# EAGLE schematic 辉光钟V2 (EAGLE 9.3.1)
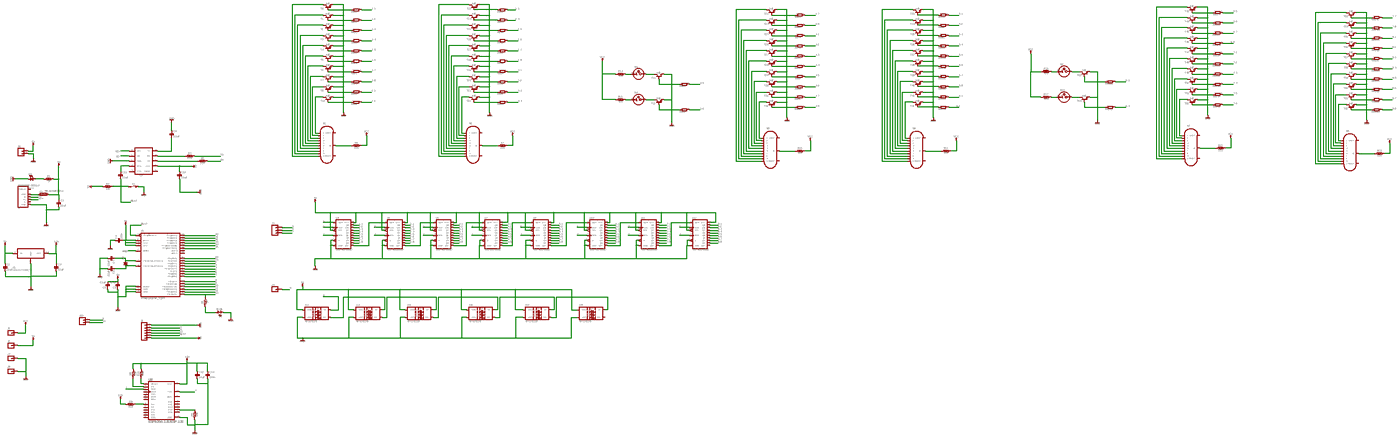
[diagram p0: schematic, sheet 1, overview]
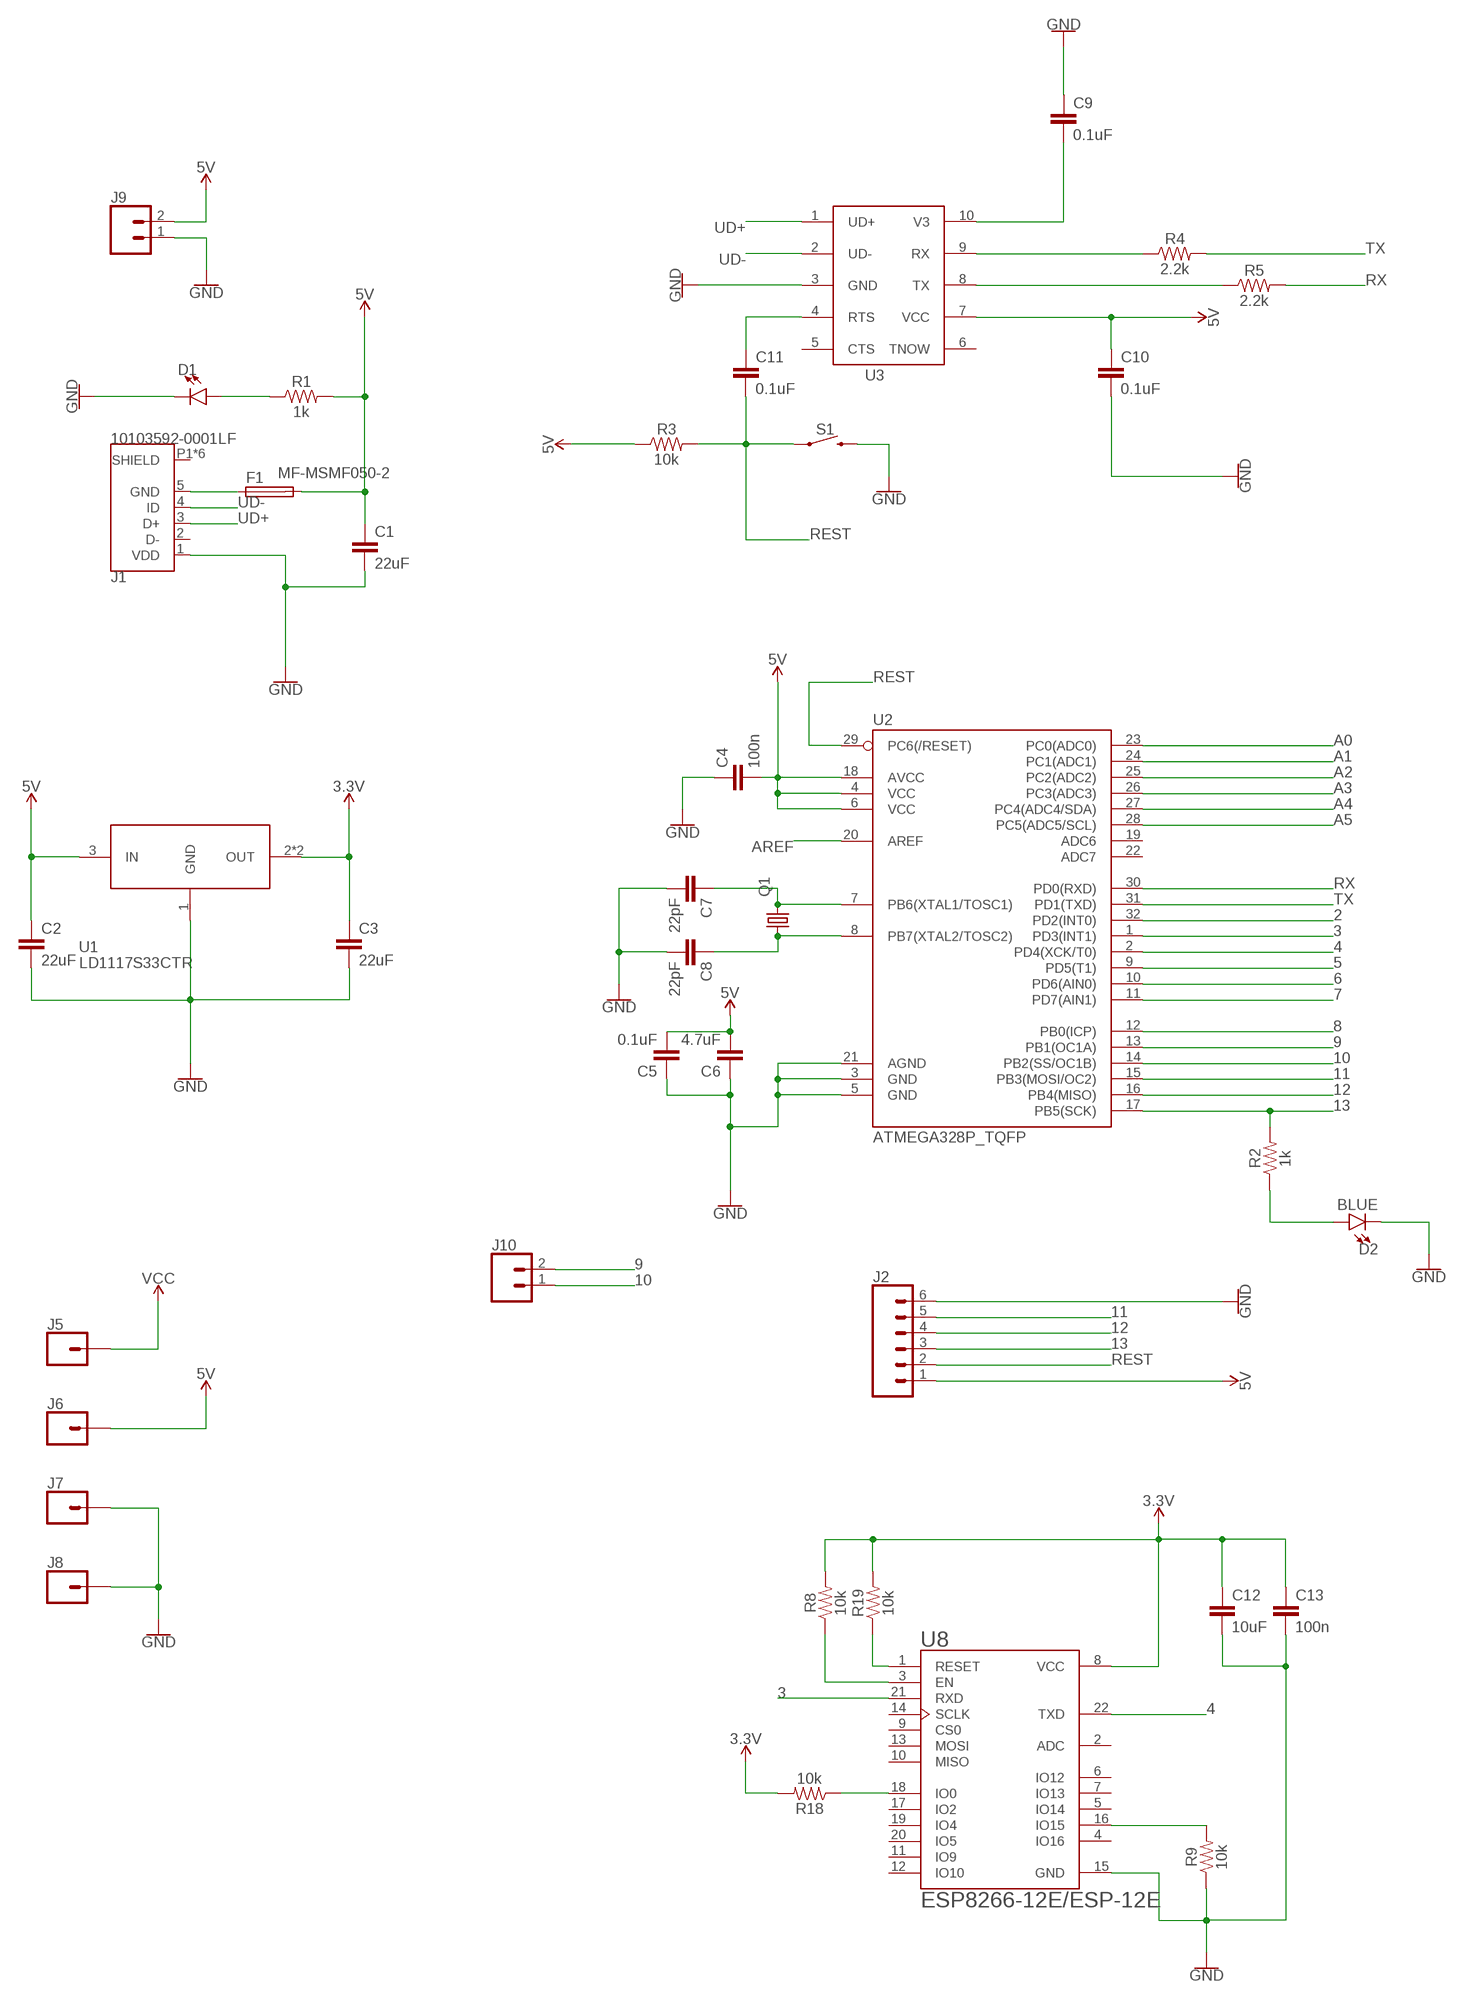
[diagram p1: schematic, sheet 1, part 1 of 4]
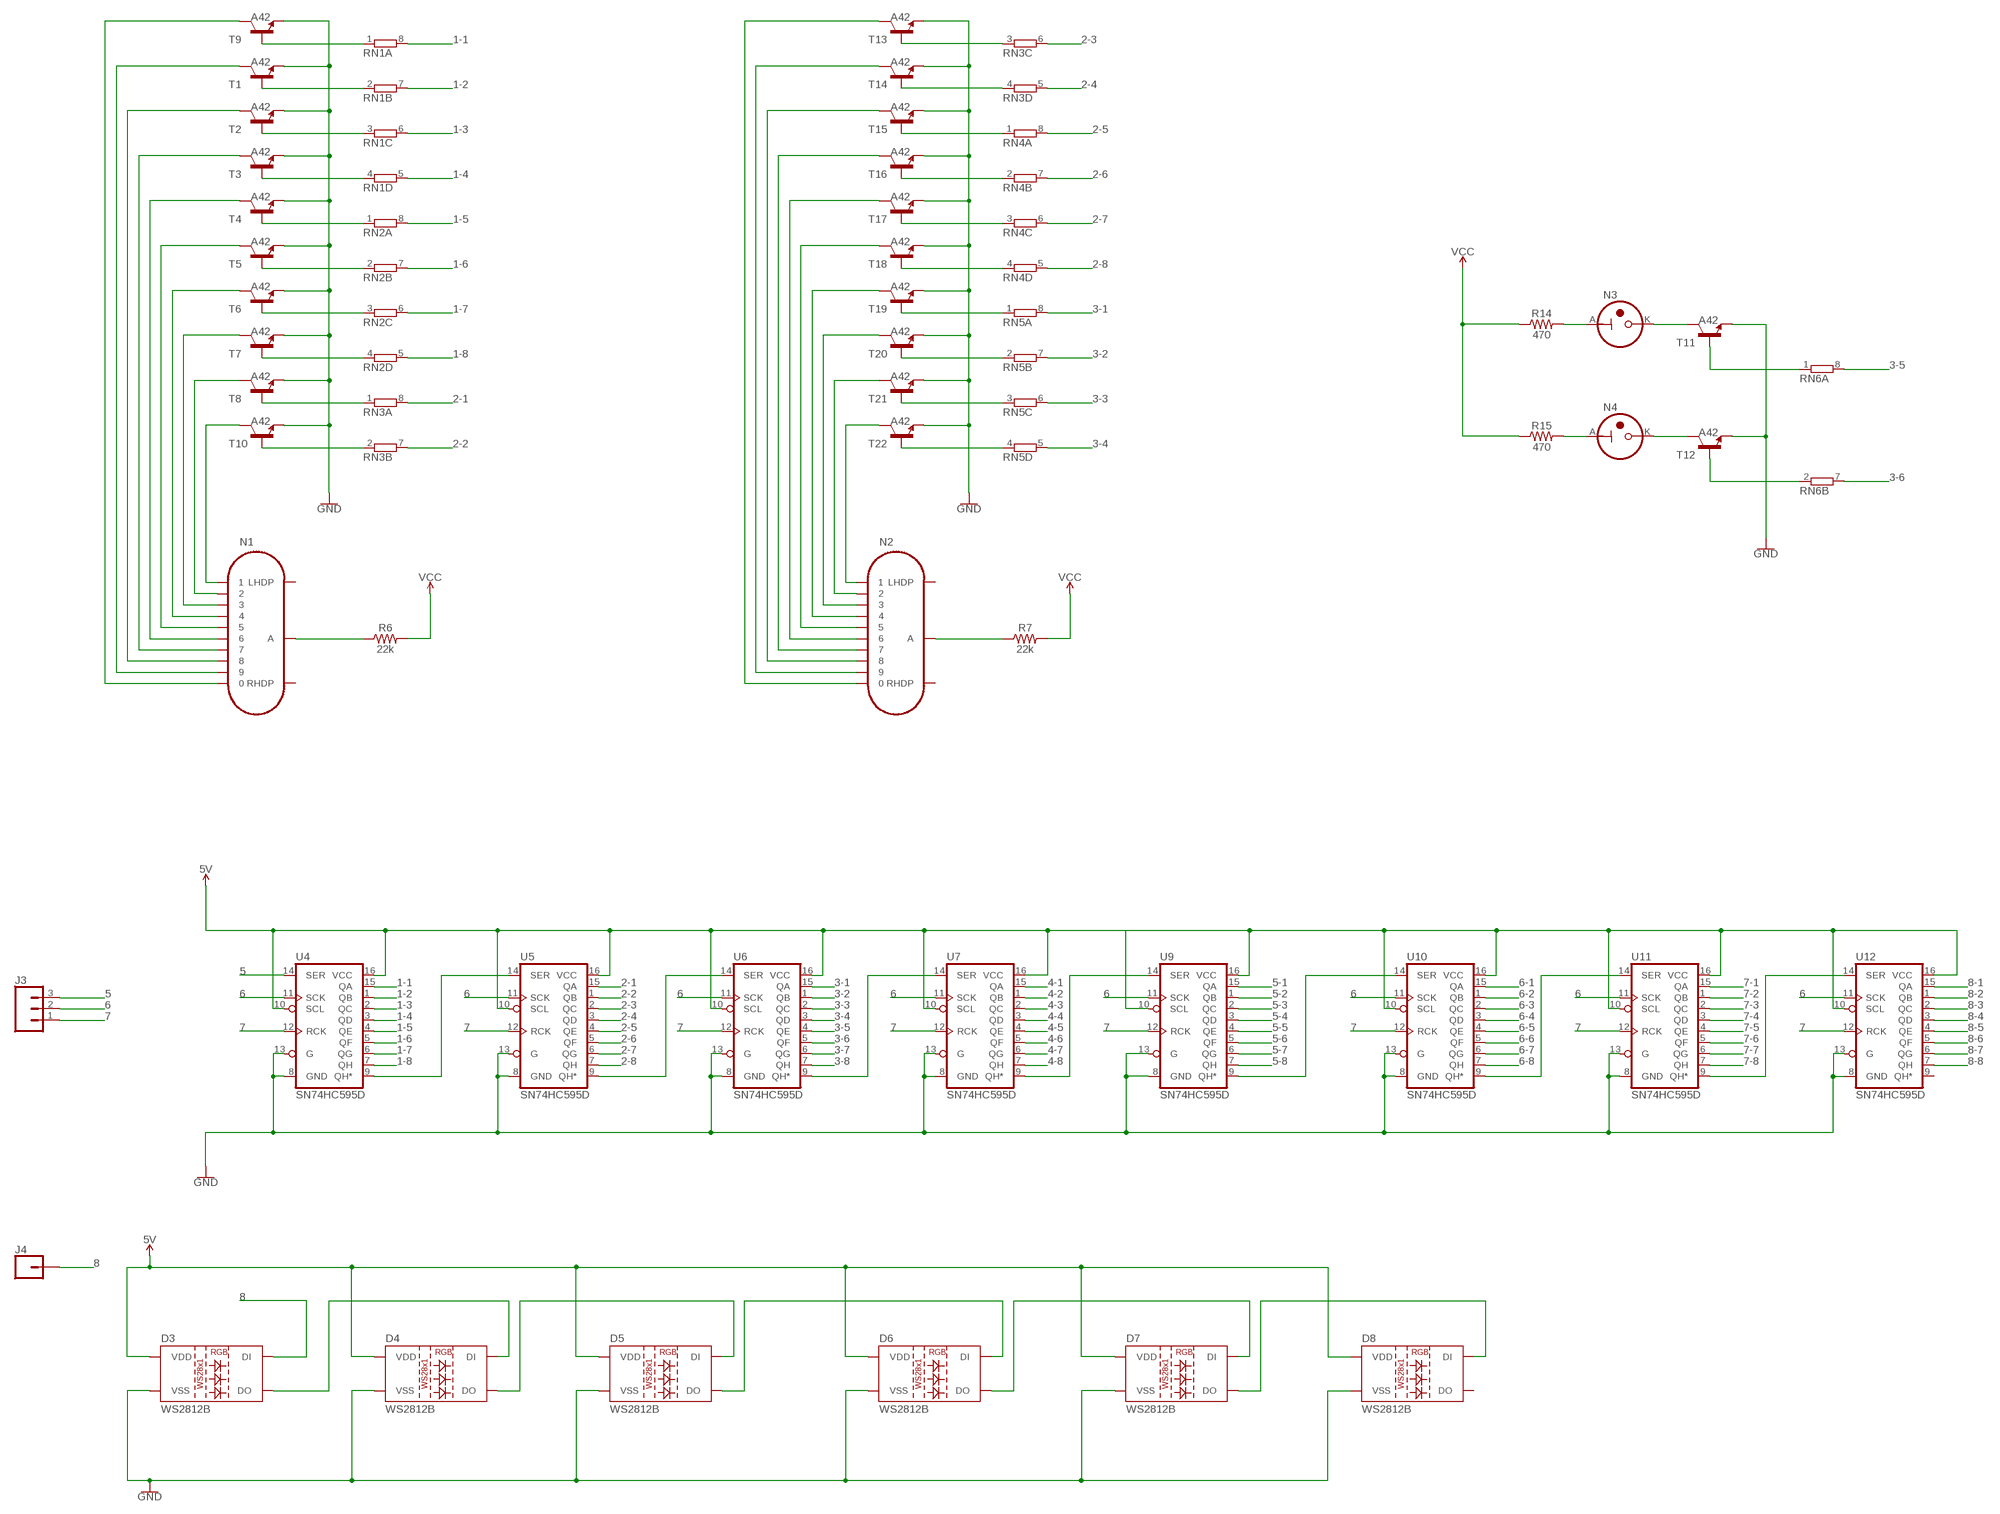
[diagram p2: schematic, sheet 1, part 2 of 4]
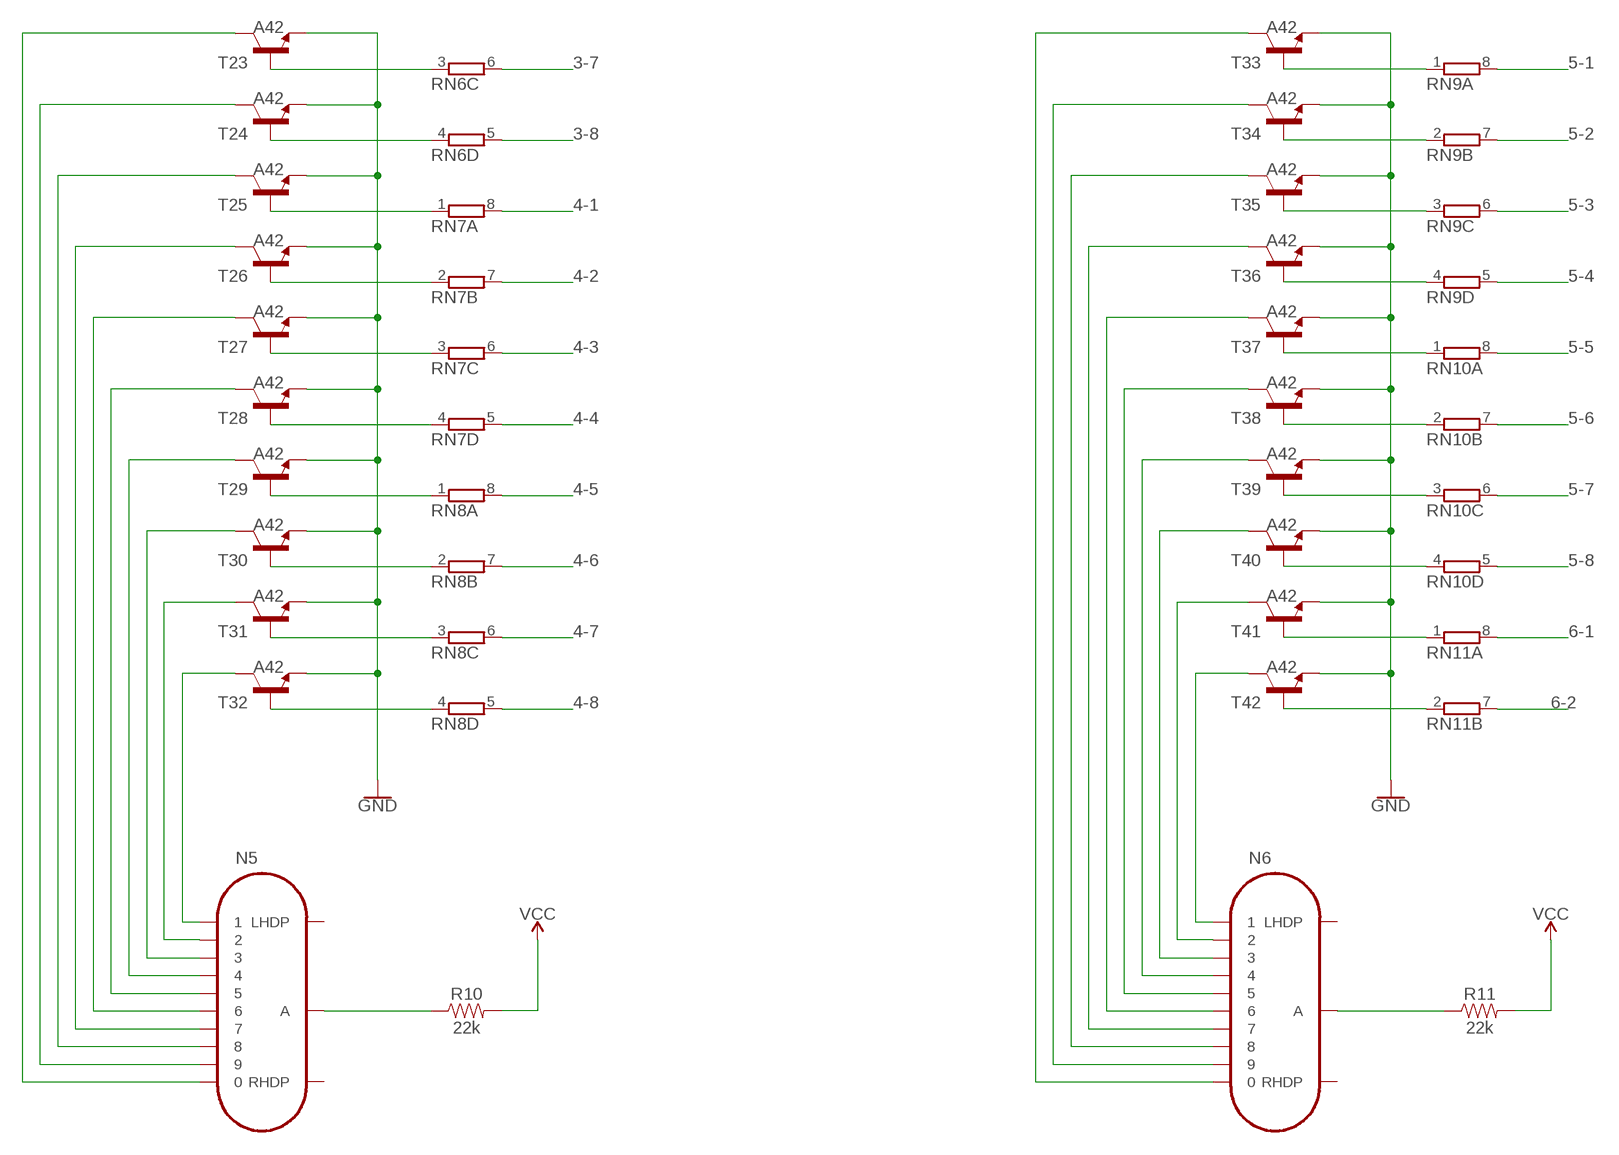
[diagram p3: schematic, sheet 1, part 3 of 4]
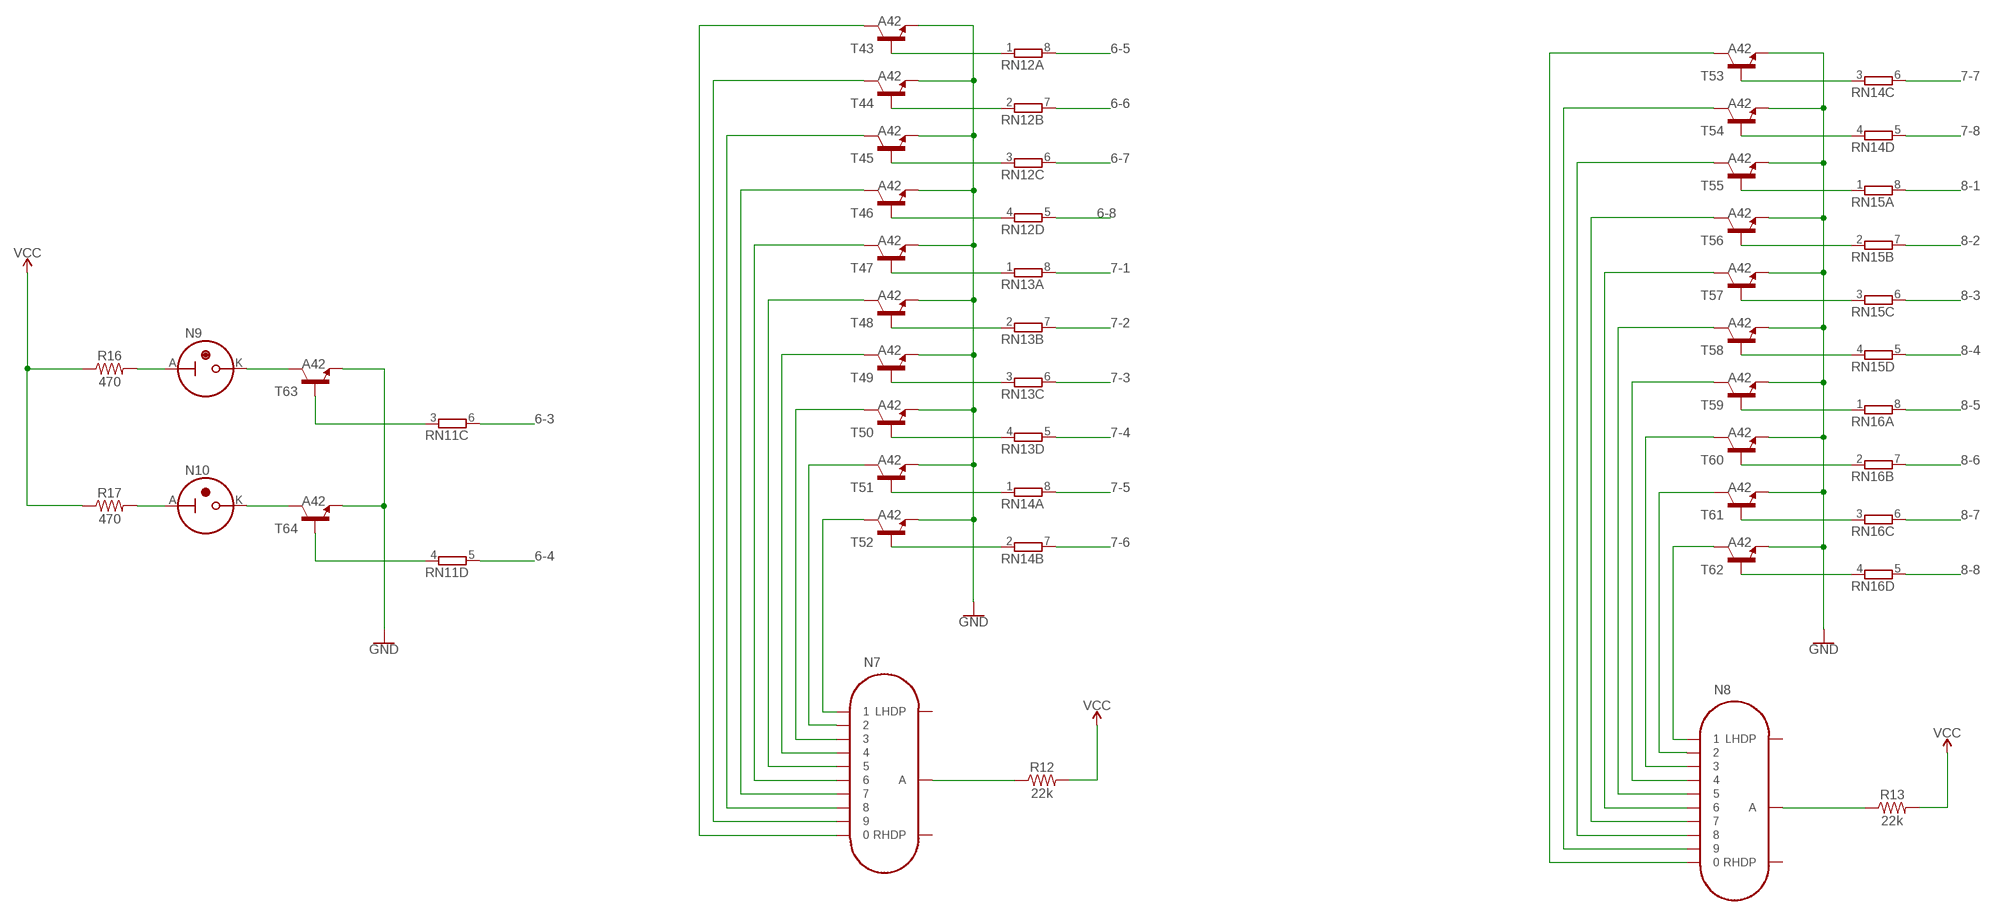
[diagram p4: schematic, sheet 1, part 4 of 4]

## Parts
C1  22uF  22UF-0805-6.3V-20%  [0805]
C2  22uF  22UF-0805-6.3V-20%  [0805]
C3  22uF  22UF-0805-6.3V-20%  [0805]
C4  100n  47NF-0603-25V-5%  [0603]
C5  0.1uF  0.1UF-0603-25V-(+80/-20%)  [0603]
C6  4.7uF  4.7UF0603  [0603]
C7  22pF  22PF-0603-50V-5%  [0603]
C8  22pF  22PF-0603-50V-5%  [0603]
C9  0.1uF  0.1UF-0603-25V-(+80/-20%)  [0603]
C10  0.1uF  0.1UF-0603-25V-(+80/-20%)  [0603]
C11  0.1uF  0.1UF-0603-25V-(+80/-20%)  [0603]
C12  10uF  10UF-0603-6.3V-20%  [0603]
C13  100n  10UF-0603-6.3V-20%  [0603]
D1  LED0603  [LED-0603]
D2  BLUE  LED-BLUE0603  [LED-0603]
D3  WS2812B  [WS2812B]
D4  WS2812B  [WS2812B]
D5  WS2812B  [WS2812B]
D6  WS2812B  [WS2812B]
D7  WS2812B  [WS2812B]
D8  WS2812B  [WS2812B]
F1  MF-MSMF050-2  [FUSM1812X02]
J1  10103592-0001LF  [AMPHENOL_10103592-0001LF]
J2  CONN_06NO_SILK_FEMALE_PTH  [1X06_NO_SILK]
J3  CONN_03  [1X03]
J4  CONN_01  [1X01]
J5  CONN_01  [1X01]
J6  CONN_01  [1X01]
J7  CONN_01  [1X01]
J8  CONN_01  [1X01]
J9  CONN_02  [1X02]
J10  CONN_02  [1X02]
N1  IN-14  [IN-14]
N2  IN-14  [IN-14]
N3  IN-3  [IN-3]
N4  IN-3  [IN-3]
N5  IN-14  [IN-14]
N6  IN-14  [IN-14]
N7  IN-14  [IN-14]
N8  IN-14  [IN-14]
N9  IN-3  [IN-3]
N10  IN-3  [IN-3]
Q1  KX-7  [3.2X2.5_KX-7]
R1  1k  1KOHM-0603-1/10W-1%  [0603]
R2  1k  1KOHM-0603-1/10W-1%  [0603]
R3  10k  10KOHM-0603-1/10W-1%  [0603]
R4  2.2k  2.2KOHM-0603-1/10W-1%  [0603]
R5  2.2k  2.2KOHM-0603-1/10W-1%  [0603]
R6  22k  22KOHM-0603-1/10W-1%  [0603]
R7  22k  22KOHM-0603-1/10W-1%  [0603]
R8  10k  1KOHM-0603-1/10W-1%  [0603]
R9  10k  1KOHM-0603-1/10W-1%  [0603]
R10  22k  22KOHM-0603-1/10W-1%  [0603]
R11  22k  22KOHM-0603-1/10W-1%  [0603]
R12  22k  22KOHM-0603-1/10W-1%  [0603]
R13  22k  22KOHM-0603-1/10W-1%  [0603]
R14  470  470OHM-0603-1/10W-1%  [0603]
R15  470  470OHM-0603-1/10W-1%  [0603]
R16  470  470OHM-0603-1/10W-1%  [0603]
R17  470  470OHM-0603-1/10W-1%  [0603]
R18  10k  1KOHM-0603-1/10W-1%  [0603]
R19  10k  1KOHM-0603-1/10W-1%  [0603]
RN1  4R-N0603-ARC  [0603-ARC]
RN2  4R-N0603-ARC  [0603-ARC]
RN3  4R-N0603-ARC  [0603-ARC]
RN4  4R-N0603-ARC  [0603-ARC]
RN5  4R-N0603-ARC  [0603-ARC]
RN6  4R-N0603-ARC  [0603-ARC]
RN7  4R-N0603-ARC  [0603-ARC]
RN8  4R-N0603-ARC  [0603-ARC]
RN9  4R-N0603-ARC  [0603-ARC]
RN10  4R-N0603-ARC  [0603-ARC]
RN11  4R-N0603-ARC  [0603-ARC]
RN12  4R-N0603-ARC  [0603-ARC]
RN13  4R-N0603-ARC  [0603-ARC]
RN14  4R-N0603-ARC  [0603-ARC]
RN15  4R-N0603-ARC  [0603-ARC]
RN16  4R-N0603-ARC  [0603-ARC]
S1  MOMENTARY-SWITCH-SPST-SMD-6.0X3.5MM  [TACTILE_SWITCH_SMD_6.0X3.5MM]
T1  A42  BC850  [SOT23]
T2  A42  BC850  [SOT23]
T3  A42  BC850  [SOT23]
T4  A42  BC850  [SOT23]
T5  A42  BC850  [SOT23]
T6  A42  BC850  [SOT23]
T7  A42  BC850  [SOT23]
T8  A42  BC850  [SOT23]
T9  A42  BC850  [SOT23]
T10  A42  BC850  [SOT23]
T11  A42  BC850  [SOT23]
T12  A42  BC850  [SOT23]
T13  A42  BC850  [SOT23]
T14  A42  BC850  [SOT23]
T15  A42  BC850  [SOT23]
T16  A42  BC850  [SOT23]
T17  A42  BC850  [SOT23]
T18  A42  BC850  [SOT23]
T19  A42  BC850  [SOT23]
T20  A42  BC850  [SOT23]
T21  A42  BC850  [SOT23]
T22  A42  BC850  [SOT23]
T23  A42  BC850  [SOT23]
T24  A42  BC850  [SOT23]
T25  A42  BC850  [SOT23]
T26  A42  BC850  [SOT23]
T27  A42  BC850  [SOT23]
T28  A42  BC850  [SOT23]
T29  A42  BC850  [SOT23]
T30  A42  BC850  [SOT23]
T31  A42  BC850  [SOT23]
T32  A42  BC850  [SOT23]
T33  A42  BC850  [SOT23]
T34  A42  BC850  [SOT23]
T35  A42  BC850  [SOT23]
T36  A42  BC850  [SOT23]
T37  A42  BC850  [SOT23]
T38  A42  BC850  [SOT23]
T39  A42  BC850  [SOT23]
T40  A42  BC850  [SOT23]
T41  A42  BC850  [SOT23]
T42  A42  BC850  [SOT23]
T43  A42  BC850  [SOT23]
T44  A42  BC850  [SOT23]
T45  A42  BC850  [SOT23]
T46  A42  BC850  [SOT23]
T47  A42  BC850  [SOT23]
T48  A42  BC850  [SOT23]
T49  A42  BC850  [SOT23]
T50  A42  BC850  [SOT23]
T51  A42  BC850  [SOT23]
T52  A42  BC850  [SOT23]
T53  A42  BC850  [SOT23]
T54  A42  BC850  [SOT23]
T55  A42  BC850  [SOT23]
T56  A42  BC850  [SOT23]
T57  A42  BC850  [SOT23]
T58  A42  BC850  [SOT23]
T59  A42  BC850  [SOT23]
T60  A42  BC850  [SOT23]
T61  A42  BC850  [SOT23]
T62  A42  BC850  [SOT23]
T63  A42  BC850  [SOT23]
T64  A42  BC850  [SOT23]
U1  LD1117S33CTR  [SOT223]
U2  ATMEGA328P_TQFP  [TQFP32-08]
U3  CH340ESMD  [MSOP10]
U4  SN74HC595D  74HC595D  [SO16]
U5  SN74HC595D  74HC595D  [SO16]
U6  SN74HC595D  74HC595D  [SO16]
U7  SN74HC595D  74HC595D  [SO16]
U8  ESP8266-12E/ESP-12E  [XCVR_ESP8266-12E/ESP-12E]
U9  SN74HC595D  74HC595D  [SO16]
U10  SN74HC595D  74HC595D  [SO16]
U11  SN74HC595D  74HC595D  [SO16]
U12  SN74HC595D  74HC595D  [SO16]

## Nets
1-1: RN1.8 U4.15(QA)
1-2: RN1.7 U4.1(QB)
1-3: RN1.6 U4.2(QC)
1-4: RN1.5 U4.3(QD)
1-5: RN2.8 U4.4(QE)
1-6: RN2.7 U4.5(QF)
1-7: RN2.6 U4.6(QG)
1-8: RN2.5 U4.7(QH)
2: U2.32(PD2(INT0))
2-1: RN3.8 U5.15(QA)
2-2: RN3.7 U5.1(QB)
2-3: RN3.6 U5.2(QC)
2-4: RN3.5 U5.3(QD)
2-5: RN4.8 U5.4(QE)
2-6: RN4.7 U5.5(QF)
2-7: RN4.6 U5.6(QG)
2-8: RN4.5 U5.7(QH)
3: U2.1(PD3(INT1)) U8.21(RXD)
3-1: RN5.8 U6.15(QA)
3-2: RN5.7 U6.1(QB)
3-3: RN5.6 U6.2(QC)
3-4: RN5.5 U6.3(QD)
3-5: RN6.8 U6.4(QE)
3-6: RN6.7 U6.5(QF)
3-7: RN6.6 U6.6(QG)
3-8: RN6.5 U6.7(QH)
3.3V: C3.1 C12.1 C13.1 R8.2 R18.2 R19.2 U1.2(OUT) U1.4(OUT) U8.8(VCC)
4: U2.2(PD4(XCK/T0)) U8.22(TXD)
4-1: RN7.8 U7.15(QA)
4-2: RN7.7 U7.1(QB)
4-3: RN7.6 U7.2(QC)
4-4: RN7.5 U7.3(QD)
4-5: RN8.8 U7.4(QE)
4-6: RN8.7 U7.5(QF)
4-7: RN8.6 U7.6(QG)
4-8: RN8.5 U7.7(QH)
5: J3.3 U2.9(PD5(T1)) U4.14(SER)
5-1: RN9.8 U9.15(QA)
5-2: RN9.7 U9.1(QB)
5-3: RN9.6 U9.2(QC)
5-4: RN9.5 U9.3(QD)
5-5: RN10.8 U9.4(QE)
5-6: RN10.7 U9.5(QF)
5-7: RN10.6 U9.6(QG)
5-8: RN10.5 U9.7(QH)
5V: C1.1 C2.1 C4.2 C5.2 C6.2 C10.1 D3.1(VDD) D4.1(VDD) D5.1(VDD) D6.1(VDD) D7.1(VDD) D8.1(VDD) F1.2 J2.1 J6.1 J9.2 R1.2 R3.1 U1.3(IN) U2.4(VCC) U2.6(VCC) U2.18(AVCC) U3.7(VCC) U4.10(SCL) U4.16(VCC) U5.10(SCL) U5.16(VCC) U6.10(SCL) U6.16(VCC) U7.10(SCL) U7.16(VCC) U9.10(SCL) U9.16(VCC) U10.10(SCL) U10.16(VCC) U11.10(SCL) U11.16(VCC) U12.10(SCL) U12.16(VCC)
6: J3.2 U2.10(PD6(AIN0)) U4.11(SCK) U5.11(SCK) U6.11(SCK) U7.11(SCK) U9.11(SCK) U10.11(SCK) U11.11(SCK) U12.11(SCK)
6-1: RN11.8 U10.15(QA)
6-2: RN11.7 U10.1(QB)
6-3: RN11.6 U10.2(QC)
6-4: RN11.5 U10.3(QD)
6-5: RN12.8 U10.4(QE)
6-6: RN12.7 U10.5(QF)
6-7: RN12.6 U10.6(QG)
6-8: RN12.5 U10.7(QH)
7: J3.1 U2.11(PD7(AIN1)) U4.12(RCK) U5.12(RCK) U6.12(RCK) U7.12(RCK) U9.12(RCK) U10.12(RCK) U11.12(RCK) U12.12(RCK)
7-1: RN13.8 U11.15(QA)
7-2: RN13.7 U11.1(QB)
7-3: RN13.6 U11.2(QC)
7-4: RN13.5 U11.3(QD)
7-5: RN14.8 U11.4(QE)
7-6: RN14.7 U11.5(QF)
7-7: RN14.6 U11.6(QG)
7-8: RN14.5 U11.7(QH)
8: D3.4(DI) J4.1 U2.12(PB0(ICP))
8-1: RN15.8 U12.15(QA)
8-2: RN15.7 U12.1(QB)
8-3: RN15.6 U12.2(QC)
8-4: RN15.5 U12.3(QD)
8-5: RN16.8 U12.4(QE)
8-6: RN16.7 U12.5(QF)
8-7: RN16.6 U12.6(QG)
8-8: RN16.5 U12.7(QH)
9: J10.2 U2.13(PB1(OC1A))
10: J10.1 U2.14(PB2(SS/OC1B))
11: J2.5 U2.15(PB3(MOSI/OC2))
12: J2.4 U2.16(PB4(MISO))
13: J2.3 R2.2 U2.17(PB5(SCK))
A0: U2.23(PC0(ADC0))
A1: U2.24(PC1(ADC1))
A2: U2.25(PC2(ADC2))
A3: U2.26(PC3(ADC3))
A4: U2.27(PC4(ADC4/SDA))
A5: U2.28(PC5(ADC5/SCL))
AREF: U2.20(AREF)
GND: C1.2 C2.2 C3.2 C4.1 C5.1 C6.1 C7.2 C8.2 C9.1 C10.2 C12.2 C13.2 D1.C D2.C D3.3(VSS) D4.3(VSS) D5.3(VSS) D6.3(VSS) D7.3(VSS) D8.3(VSS) J1.1(VDD) J2.6 J7.1 J8.1 J9.1 R9.1 S1.2 T1.2(E) T2.2(E) T3.2(E) T4.2(E) T5.2(E) T6.2(E) T7.2(E) T8.2(E) T9.2(E) T10.2(E) T11.2(E) T12.2(E) T13.2(E) T14.2(E) T15.2(E) T16.2(E) T17.2(E) T18.2(E) T19.2(E) T20.2(E) T21.2(E) T22.2(E) T23.2(E) T24.2(E) T25.2(E) T26.2(E) T27.2(E) T28.2(E) T29.2(E) T30.2(E) T31.2(E) T32.2(E) T33.2(E) T34.2(E) T35.2(E) T36.2(E) T37.2(E) T38.2(E) T39.2(E) T40.2(E) T41.2(E) T42.2(E) T43.2(E) T44.2(E) T45.2(E) T46.2(E) T47.2(E) T48.2(E) T49.2(E) T50.2(E) T51.2(E) T52.2(E) T53.2(E) T54.2(E) T55.2(E) T56.2(E) T57.2(E) T58.2(E) T59.2(E) T60.2(E) T61.2(E) T62.2(E) T63.2(E) T64.2(E) U1.1(GND) U2.3(GND) U2.5(GND) U2.21(AGND) U3.3(GND) U4.8(GND) U4.13(G) U5.8(GND) U5.13(G) U6.8(GND) U6.13(G) U7.8(GND) U7.13(G) U8.15(GND) U9.8(GND) U9.13(G) U10.8(GND) U10.13(G) U11.8(GND) U11.13(G) U12.8(GND) U12.13(G)
N$1: F1.1 J1.5(GND)
N$2: U4.9(QH*) U5.14(SER)
N$3: U5.9(QH*) U6.14(SER)
N$4: C7.1 Q1.3 U2.7(PB6(XTAL1/TOSC1))
N$5: D1.A R1.1
N$6: C8.1 Q1.1 U2.8(PB7(XTAL2/TOSC2))
N$7: U6.9(QH*) U7.14(SER)
N$8: D2.A R2.1
N$9: C11.1 U3.4(RTS)
N$20: N1.1 T10.3(C)
N$21: N1.2 T8.3(C)
N$22: N1.3 T7.3(C)
N$23: N1.4 T6.3(C)
N$24: N1.5 T5.3(C)
N$25: N1.6 T4.3(C)
N$26: N1.7 T3.3(C)
N$27: N1.8 T2.3(C)
N$28: N1.9 T1.3(C)
N$29: N1.0 T9.3(C)
N$30: RN1.1 T9.1(B)
N$31: RN1.2 T1.1(B)
N$32: RN1.3 T2.1(B)
N$33: RN1.4 T3.1(B)
N$34: R4.1 U3.9(RX)
N$35: R5.1 U3.8(TX)
N$36: RN2.1 T4.1(B)
N$37: RN2.2 T5.1(B)
N$38: C9.2 U3.10(V3)
N$39: RN2.3 T6.1(B)
N$40: RN2.4 T7.1(B)
N$43: N1.A R6.1
N$44: RN3.1 T8.1(B)
N$45: RN3.2 T10.1(B)
N$46: N2.1 T22.3(C)
N$47: N2.2 T21.3(C)
N$48: N2.3 T20.3(C)
N$49: N2.4 T19.3(C)
N$50: N2.5 T18.3(C)
N$51: N2.6 T17.3(C)
N$52: N2.7 T16.3(C)
N$53: N2.8 T15.3(C)
N$54: N2.9 T14.3(C)
N$55: N2.0 T13.3(C)
N$56: N2.A R7.1
N$59: RN3.3 T13.1(B)
N$60: RN3.4 T14.1(B)
N$61: RN4.1 T15.1(B)
N$62: RN4.2 T16.1(B)
N$63: RN4.3 T17.1(B)
N$64: RN4.4 T18.1(B)
N$65: RN5.1 T19.1(B)
N$66: RN5.2 T20.1(B)
N$67: RN5.3 T21.1(B)
N$68: RN5.4 T22.1(B)
N$76: R8.1 U8.3(EN)
N$77: R9.2 U8.16(IO15)
N$82: U7.9(QH*) U9.14(SER)
N$84: N5.1 T32.3(C)
N$85: N5.2 T31.3(C)
N$86: N5.3 T30.3(C)
N$87: N5.4 T29.3(C)
N$88: N5.5 T28.3(C)
N$89: N5.6 T27.3(C)
N$90: N5.7 T26.3(C)
N$91: N5.8 T25.3(C)
N$92: N5.9 T24.3(C)
N$93: N5.0 T23.3(C)
N$94: N5.A R10.1
N$97: RN6.3 T23.1(B)
N$98: RN6.4 T24.1(B)
N$99: RN7.1 T25.1(B)
N$100: RN7.2 T26.1(B)
N$101: RN7.3 T27.1(B)
N$102: RN7.4 T28.1(B)
N$103: RN8.1 T29.1(B)
N$104: RN8.2 T30.1(B)
N$105: RN8.3 T31.1(B)
N$106: RN8.4 T32.1(B)
N$117: N6.1 T42.3(C)
N$118: N6.2 T41.3(C)
N$119: N6.3 T40.3(C)
N$120: N6.4 T39.3(C)
N$121: N6.5 T38.3(C)
N$122: N6.6 T37.3(C)
N$123: N6.7 T36.3(C)
N$124: N6.8 T35.3(C)
N$125: N6.9 T34.3(C)
N$126: N6.0 T33.3(C)
N$127: N6.A R11.1
N$130: RN9.1 T33.1(B)
N$131: RN9.2 T34.1(B)
N$132: RN9.3 T35.1(B)
N$133: RN9.4 T36.1(B)
N$134: RN10.1 T37.1(B)
N$135: RN10.2 T38.1(B)
N$136: RN10.3 T39.1(B)
N$137: RN10.4 T40.1(B)
N$138: RN11.1 T41.1(B)
N$139: RN11.2 T42.1(B)
N$150: N7.1 T52.3(C)
N$151: N7.2 T51.3(C)
N$152: N7.3 T50.3(C)
N$153: N7.4 T49.3(C)
N$154: N7.5 T48.3(C)
N$155: N7.6 T47.3(C)
N$156: N7.7 T46.3(C)
N$157: N7.8 T45.3(C)
N$158: N7.9 T44.3(C)
N$159: N7.0 T43.3(C)
N$160: N7.A R12.1
N$163: RN12.1 T43.1(B)
N$164: RN12.2 T44.1(B)
N$165: RN12.3 T45.1(B)
N$166: RN12.4 T46.1(B)
N$167: RN13.1 T47.1(B)
N$168: RN13.2 T48.1(B)
N$169: RN13.3 T49.1(B)
N$170: RN13.4 T50.1(B)
N$171: RN14.1 T51.1(B)
N$172: RN14.2 T52.1(B)
N$183: N8.1 T62.3(C)
N$184: N8.2 T61.3(C)
N$185: N8.3 T60.3(C)
N$186: N8.4 T59.3(C)
N$187: N8.5 T58.3(C)
N$188: N8.6 T57.3(C)
N$189: N8.7 T56.3(C)
N$190: N8.8 T55.3(C)
N$191: N8.9 T54.3(C)
N$192: N8.0 T53.3(C)
N$193: N8.A R13.1
N$196: RN14.3 T53.1(B)
N$197: RN14.4 T54.1(B)
N$198: RN15.1 T55.1(B)
N$199: RN15.2 T56.1(B)
N$200: RN15.3 T57.1(B)
N$201: RN15.4 T58.1(B)
N$202: RN16.1 T59.1(B)
N$203: RN16.2 T60.1(B)
N$204: RN16.3 T61.1(B)
N$205: RN16.4 T62.1(B)
N$216: N3.A R14.2
N$217: N3.K T11.3(C)
N$218: N4.A R15.2
N$219: N4.K T12.3(C)
N$220: RN6.1 T11.1(B)
N$221: RN6.2 T12.1(B)
N$224: N9.A R16.2
N$225: N9.K T63.3(C)
N$226: N10.A R17.2
N$227: N10.K T64.3(C)
N$228: RN11.3 T63.1(B)
N$229: RN11.4 T64.1(B)
N$232: R19.1 U8.1(RESET)
N$233: D3.2(DO) D4.4(DI)
N$234: R18.1 U8.18(IO0)
N$235: D4.2(DO) D5.4(DI)
N$236: D5.2(DO) D6.4(DI)
N$237: D6.2(DO) D7.4(DI)
N$238: D7.2(DO) D8.4(DI)
N$241: U10.9(QH*) U11.14(SER)
N$248: U11.9(QH*) U12.14(SER)
N$256: U9.9(QH*) U10.14(SER)
REST: C11.2 J2.2 R3.2 S1.1 U2.29(PC6(/RESET))
RX: R5.2 U2.30(PD0(RXD))
TX: R4.2 U2.31(PD1(TXD))
UD+: J1.3(D+) U3.1(UD+)
UD-: J1.4(ID) U3.2(UD-)
VCC: J5.1 R6.2 R7.2 R10.2 R11.2 R12.2 R13.2 R14.1 R15.1 R16.1 R17.1
Unconnected: D8.2(DO) J1.2(D-) N1.LHDP N1.RHDP N2.LHDP N2.RHDP N5.LHDP N5.RHDP N6.LHDP N6.RHDP N7.LHDP N7.RHDP N8.LHDP N8.RHDP U2.19(ADC6) U2.22(ADC7) U3.5(CTS) U3.6(TNOW) U8.2(ADC) U8.4(IO16) U8.5(IO14) U8.6(IO12) U8.7(IO13) U8.9(CS0) U8.10(MISO) U8.11(IO9) U8.12(IO10) U8.13(MOSI) U8.14(SCLK) U8.17(IO2) U8.19(IO4) U8.20(IO5) U12.9(QH*)

## Power pins joined to a net without a drawn wire
SHIELD: J1.P1(SHIELD) J1.P2(SHIELD) J1.P3(SHIELD) J1.P4(SHIELD) J1.P5(SHIELD) J1.P6(SHIELD)

## Library data of the parts
C1-C3 = SparkFun-Capacitors:22UF: 22µF ceramic capacitors A capacitor is a passive two-terminal electrical component used to store electrical energy temporarily in an electric field.; PROD_ID: CAP-08402
C4 = SparkFun-Capacitors:47NF: 47nF ceramic capacitors A capacitor is a passive two-terminal electrical component used to store electrical energy temporarily in an electric field.; PROD_ID: CAP-08605; VALUE: 47nF
C5 C9-C11 = SparkFun-Capacitors:0.1UF: 0.1µF ceramic capacitors A capacitor is a passive two-terminal electrical component used to store electrical energy temporarily in an electric field.; PROD_ID: CAP-00810
C6 = SparkFun-Capacitors:4.7UF: 4.7µF ceramic capacitors A capacitor is a passive two-terminal electrical component used to store electrical energy temporarily in an electric field.; PROD_ID: CAP-08280
C7 C8 = SparkFun-Capacitors:22PF: 22pF ceramic capacitors A capacitor is a passive two-terminal electrical component used to store electrical energy temporarily in an electric field.; PROD_ID: CAP-07876
C12 = SparkFun-Capacitors:10UF: 10.0µF ceramic capacitors A capacitor is a passive two-terminal electrical component used to store electrical energy temporarily in an electric field.; PROD_ID: CAP-11015
C13 = SparkFun-Capacitors:10UF: 10.0µF ceramic capacitors A capacitor is a passive two-terminal electrical component used to store electrical energy temporarily in an electric field.; PROD_ID: CAP-11015; VALUE: 10uF
D1 = SparkFun-LED:LED: LED (Generic) Standard schematic elements and footprints for 5mm, 3mm, 1206, and 0603 sized LEDs. Generic LEDs with no color specified.
D2 = SparkFun-LED:LED-BLUE: Blue SMD LED Used in manufacturing of various products at SparkFun Packages: 0603 - SMD 0603 package [Product Link] <http://www.digikey.com/product-detail/en/SMLE12BC7TT86/511-1589-2-ND/1641808> 1206 - SMD1206 package [Product Link] <http://www.digikey.com/product-detail/en/lite-on-inc/LTST-C150TBKT/160-1643-1-ND/573584> SparkFun Products: ESP8266 Thing-Dev Board <https://www.sparkfun.com/products/13711> RedBoard <https://www.sparkfun.com/products/12757>; PROD_ID: DIO-08575
D3-D8 = SparkFun-LED:WS2812B: WS2812B SMD addressable RGB LED 5x5mm SMD LED with built-in controller IC. Color: Red/Green/Blue mC Rating: RGB: 390, 660, 180 mcd Forward Voltage: RGB: 2.0, 3.0, 3.0 V Packages:WS2812B SparkFun Products: Blynk Board - ESP8266 <https://www.sparkfun.com/products/13794>; PROD_ID: DIO-12503
F1 = MF-MSMF050-2:MF-MSMF050-2: PTC Resettable Fuse 0.5A(hold) 1A(trip) 15V 100A 0.8W 0.15s 0.15Ohm SMD Solder Pad 1812 T/R; AVAILABILITY: Unavailable; DESCRIPTION: PTC Resettable Fuse 0.5A_hold_ 1A_trip_ 15V 100A 0.8W 0.15s 0.15Ohm SMD Solder Pad 1812 T/R; MF: Bourns; MP: MF-MSMF050-2; PACKAGE: 1812 Bourns; PRICE: None
J1 = usb:10103592-0001LF: Conn Micro USB Type B RCP 5 POS 0.65mm Solder RA SMD 5 Terminal 1 Port T/R; AVAILABILITY: Unavailable; DESCRIPTION: Micro Usb, 2.0 Type b, Rcpt, Smt; MF: Amphenol ICC; MP: 10103592-0001LF; PACKAGE: None; PRICE: None
J2 = SparkFun-Connectors:CONN_06: Multi connection point. Often used as Generic Header-pin footprint for 0.1 inch spaced/style header connections On any of the 0.1 inch spaced packages, you can populate with these: Break Away Headers - Straight (PRT-00116) Break Away Male Headers - Right Angle (PRT-00553) Female Headers (PRT-00115) Break Away Headers - Machine Pin (PRT-00117) Break Away Female Headers - Swiss Machine Pin (PRT-00743) Arduino Stackable Header - 6 Pin (PRT-09280) For SCREWTERMINALS and SPRING TERMINALS visit here: Screw Terimnals on SparkFun.com (5mm/3.5mm/2.54mm spacing) This device is also useful as a general connection point to wire up your design to another part of your project. Our various solder wires solder well into these plated through hole pads. Hook-Up Wire - Assortment (Stranded, 22 AWG) (PRT-11375) Hook-Up Wire - Assortment (Solid Core, 22 AWG) (PRT-11367) View the entire wire category on our website here; PROD_ID: CONN-08437
J3 = SparkFun-Connectors:CONN_03: Multi connection point. Often used as Generic Header-pin footprint for 0.1 inch spaced/style header connections On any of the 0.1 inch spaced packages, you can populate with these: Break Away Headers - Straight (PRT-00116) Break Away Male Headers - Right Angle (PRT-00553) Female Headers (PRT-00115) Break Away Headers - Machine Pin (PRT-00117) Break Away Female Headers - Swiss Machine Pin (PRT-00743) Stackable Header - 3 Pin (Female, 0.1") (PRT-13875) For SCREWTERMINALS and SPRING TERMINALS visit here: Screw Terimnals on SparkFun.com (5mm/3.5mm/2.54mm spacing) This device is also useful as a general connection point to wire up your design to another part of your project. Our various solder wires solder well into these plated through hole pads. Hook-Up Wire - Assortment (Stranded, 22 AWG) (PRT-11375) Hook-Up Wire - Assortment (Solid Core, 22 AWG) (PRT-11367) View the entire wire category on our website here Special notes: Molex polarized connector foot print use with SKU : PRT-08232 with associated crimp pins and housings.
J4-J8 = SparkFun-Connectors:CONN_01: Single connection point. Often used as Generic Header-pin footprint for 0.1 inch spaced/style header connections On any of the 0.1 inch spaced packages, you can populate with these: Break Away Headers - Straight (PRT-00116) Break Away Male Headers - Right Angle (PRT-00553) Female Headers (PRT-00115) Break Away Headers - Machine Pin (PRT-00117) Break Away Female Headers - Swiss Machine Pin (PRT-00743) This device is also useful as a general connection point to wire up your design to another part of your project. Our various solder wires solder well into these plated through hole pads. Hook-Up Wire - Assortment (Stranded, 22 AWG) (PRT-11375) Hook-Up Wire - Assortment (Solid Core, 22 AWG) (PRT-11367) View the entire wire category on our website here Special notes: SMTSO-256-ET is a "flush mount" nut for a 4-40 screw. We mostly use this on specialty testbeds; it is a nice way to connect hardware to your PCB at an adjustable hieght. Also note, the SNAP packages are for using a snappable style connector. We sell a baggie of snaps and they are also used on two LilyPad designs: Snap Assortment - 30 pack (male and female) (DEV-11347) LilyPad Arduino SimpleSnap (DEV-10941) LilyPad SimpleSnap Protoboard (DEV-10940)
J9 J10 = SparkFun-Connectors:CONN_02: Multi connection point. Often used as Generic Header-pin footprint for 0.1 inch spaced/style header connections On any of the 0.1 inch spaced packages, you can populate with these: Break Away Headers - Straight (PRT-00116) Break Away Male Headers - Right Angle (PRT-00553) Female Headers (PRT-00115) Break Away Headers - Machine Pin (PRT-00117) Break Away Female Headers - Swiss Machine Pin (PRT-00743) For SCREWTERMINALS and SPRING TERMINALS visit here: Screw Terimnals on SparkFun.com (5mm/3.5mm/2.54mm spacing) This device is also useful as a general connection point to wire up your design to another part of your project. Our various solder wires solder well into these plated through hole pads. Hook-Up Wire - Assortment (Stranded, 22 AWG) (PRT-11375) Hook-Up Wire - Assortment (Solid Core, 22 AWG) (PRT-11367) View the entire wire category on our website here Special notes: Molex polarized connector foot print use with: PRT-08233 with associated crimp pins and housings. 2.54_SCREWTERM for use with PRT-10571. 3.5mm Screw Terminal footprints for PRT-08084 5mm Screw Terminal footprints for use with PRT-08432
N1 N2 N5-N8 = russian-nixies:IN-14: IN-14: medium numeric frontview nixie tube
N3 N4 N9 N10 = russian-nixies:IN-3: IN-3: nixie bulb
Q1 = crystal-geyer_V1_0:KX: Quartz Crystals (MHz) SMD: KX - Serie Model Size l/w/h [mm] Frequency Range Frequency Stability Temp. Range [°C] Load Capacitance AECQ 200 availabel Datasheet KX-4 KX-5 KX-6 KX-7 KX-9A KX-9B KX-12A KX-12B KX-13 KX-20 KX-K KX-KS 1.6/1.2/0.3 2.0/1.6/0.45 2.5/2.0/0.55 3.2/2.5/0.8 5.0/3.2/1.0 5.0/3.2/1.1 6.0/3.5/1.1 6.0/3.5/1.0 7.0/5.0 /1.3 11.6/5.5/1.6 12.3/4.5/4.2 12.3/4.5/3.2 24.0 ~ 80.0 MHz 16.0 ~ 80.0 MHz 12.0 ~ 80.0 MHz 8.0 ~ 60.0 MHz 7,68 ~ 300,0 MHz 8,0 ~ 50,0 MHz 8,0 ~ 150,0 MHz 8,0 ~ 50,0 MHz 6,0 ~ 160,0 MHz 3,579 ~ 25,0 MHz 3,579 ~ 70,0 MHz 3,579 ~ 70,0 MHz ±10 … ±50ppm ±10 … ±50ppm ±10 … ±50ppm ±10 … ±50ppm ±10 … ±50ppm ±10 … ±50ppm ±10 … ±50ppm ±10 … ±50ppm ±10 … ±50ppm ±50ppm ±10 … ±50ppm ±10 … ±50ppm (*) -40°C …+85°C (*) -40°C …+125°C (*) -40°C …+125°C (*) -40°C …+125°C (*) -40°C …+105°C (*) -40°C …+105°C (*) -40°C …+125°C (*) -40°C …+105°C (*) -40°C …+105°C (*) -40°C …+105°C (*) -40°C …+85°C (*) -40°C …+85°C 8, 8…16 8, 8…16 10, 8…16 12, 7…20 16, 10…20 16, 10…20 16, 10…20 16, 12…20 16, 12…20 16, 12…20 16, 12…30 16, 12…30 - yes yes yes - - - - - - - - KX-4.pdf KX-5.pdf KX-6.pdf KX-7.pdf KX-9A.pdf KX-9B.pdf KX-12A.pdf KX-12B.pdf KX-13.pdf KX-20.pdf KX-K.pdf KX-KS.pdf Details see: http://www.geyer-electronic.de/Frequenz-Produkte.9.0.html Created 2016-06-07, Hans Locher 2016 (C) Geyer Quartz Technology KX4,KX5,KX6,KX7,KX9A,KX9B,KX12A,KX12B,KX13,KX20,KXK,KXKS;1612;2016;2520;3225;5032;6035;7050;11655;12345;1,6x1,2;2,0x1,6;2,5x2,0;3,2x2,5;5,0x3,2;6,0x3,5;7,0x5,0;11,6x5,5;12,3x4,5;12,3x4,5;1.6x1.2;2.0x1.6;2.5x2.0;3.2x2.5;5.0x3.2;6.0x3.5;7.0x5.0;11.6x5.5;12.3x4.5;12.3x4.5;
R1 R2 = SparkFun-Resistors:1KOHM: 1kΩ resistor A resistor is a passive two-terminal electrical component that implements electrical resistance as a circuit element. Resistors act to reduce current flow, and, at the same time, act to lower voltage levels within circuits. - Wikipedia; PROD_ID: RES-07856
R3 = SparkFun-Resistors:10KOHM: 10kΩ resistor A resistor is a passive two-terminal electrical component that implements electrical resistance as a circuit element. Resistors act to reduce current flow, and, at the same time, act to lower voltage levels within circuits. - Wikipedia; PROD_ID: RES-00824
R4 R5 = SparkFun-Resistors:2.2KOHM: 2.2kΩ resistor A resistor is a passive two-terminal electrical component that implements electrical resistance as a circuit element. Resistors act to reduce current flow, and, at the same time, act to lower voltage levels within circuits. - Wikipedia; PROD_ID: RES-08272
R6 R7 R10-R13 = SparkFun-Resistors:22KOHM: 22kΩ resistor A resistor is a passive two-terminal electrical component that implements electrical resistance as a circuit element. Resistors act to reduce current flow, and, at the same time, act to lower voltage levels within circuits. - Wikipedia; PROD_ID: RES-07853
R8 R9 R18 R19 = SparkFun-Resistors:1KOHM: 1kΩ resistor A resistor is a passive two-terminal electrical component that implements electrical resistance as a circuit element. Resistors act to reduce current flow, and, at the same time, act to lower voltage levels within circuits. - Wikipedia; PROD_ID: RES-07856; VALUE: 1k
R14-R17 = SparkFun-Resistors:470OHM: 470Ω resistor A resistor is a passive two-terminal electrical component that implements electrical resistance as a circuit element. Resistors act to reduce current flow, and, at the same time, act to lower voltage levels within circuits. - Wikipedia; PROD_ID: RES-07869
RN1-RN16 = resistor-dil:4R-N: Array Chip Resistor Source: RS Component / Phycomp; OC_FARNELL: unknown; OC_NEWARK: unknown
S1 = SparkFun-Switches:MOMENTARY-SWITCH-SPST: Momentary Switch (Pushbutton) - SPST Normally-open (NO) SPST momentary switches (buttons, pushbuttons). Variants PTH-12MM - 12mm square, through-hole Momentary Pushbutton Switch - 12mm Square (COM-09190) PTH-6.0MM, PTH-6.0MM-KIT - 6.0mm square, through-hole Mini Pushbutton Switch (COM-00097) KIT package intended for soldering kit's - only one side of pads' copper is exposed. PTH-RIGHT-ANGLE-KIT - Right-angle, through-hole Right Angle Tactile Button - Used on SparkFun BigTime Watch Kit SMD-12MM - 12mm square, surface-mount Tactile Button - SMD (12mm) (COM-12993) Used on SparkFun PicoBoard SMD-4.5MM - 4.5mm Square Trackball Switch Used on SparkFun Blackberry Trackballer Breakout SMD-4.6MMX2.8MM - 4.60mm x 2.80mm, surface mount Used on SparkFun SAMD21 Mini Breakout SMD-5.2MM, SMD-5.2-REDUNDANT - 5.2mm square, surface-mount Mini Pushbutton Switch - SMD (COM-08720) Used on Arduino Pro Mini REDUNDANT package connects both switch circuits together SMD-6.0X3.5MM - 6.0 x 3.5mm, surface mount Momentary Reset Switch SMD (COM-08229) SMD-6.2MM-TALL - 6.2mm square, surface mount Tactile Button - SMD (6mm) Used on SparkFun Digital Sandbox SMD-RIGHT-ANGLE - Right-angle, surface mount Used on SparkFun Block for Intel® Edison - Arduino; PROD_ID: SWCH-00815; SF_SKU: COM-08229
T1-T64 = transistor:BC850: NPN TRANSISTOR
U1 = LD1117S33CTR:LD1117S33CTR: http://octopart.com/ld1117s33tr-stmicroelectronics-526708; AVAILABILITY: Unavailable; DESCRIPTION: LD1117 Series 1300 mA 3.3 V Fixed Output Positive Voltage LDO Regulator- SOT-223; MF: STMicroelectronics; MP: LD1117S33CTR; PACKAGE: SOT-223 STMicroelectronics; PRICE: None
U2 = SparkFun-IC-Microcontroller:ATMEGA328P_TQFP: Popular 328P in QFP Storefront component: ATmega328 - TQFP (COM-13448) Datasheet SparkFun Products SparkFun RedBoard - Programmed with Arduino (DEV-12757) Arduino Pro Mini 328 - 5V/16MHz (DEV-11113) Arduino Pro Mini 328 - 3.3V/8MHz (DEV-11114) SparkFun OpenLog (DEV-13712) SparkFun MicroView - OLED Arduino Module (DEV-12923) SparkFun Digital Sandbox (DEV-12651) SparkFun PicoBoard (WIG-11888) Arduino Fio (DEV-10116) LilyPad Arduino 328 Main Board (DEV-13342) SparkFun RedStick (DEV-13741) LilyPad MP3 (DEV-11013) LilyPad Arduino SimpleSnap (DEV-10941) SparkFun Stepoko (ROB-13899) SparkFun Geiger Counter (SEN-11345) SparkFun EL Sequencer (COM-12781) Arduino Pro 328 - 5V/16MHz (DEV-10915) CryptoCape (DEV-12773) SparkFun IR Thermometer Evaluation Board - MLX90614 (SEN-10740) SparkFun RedBot Mainboard (ROB-12097) Arduino Pro 328 - 3.3V/8MHz (DEV-10914) SparkFun Block for Intel® Edison - Arduino (DEV-13036) SparkFun Simon Says - Surface Mount Soldering Kit (KIT-10935) SparkFun 7-Segment Serial Display - Red (COM-11441) SparkFun 7-Segment Serial Display - White (COM-11629) SparkFun 7-Segment Serial Display - Yellow (COM-11443) SparkFun 7-Segment Serial Display - Kelly Green (COM-11440) SparkFun 7-Segment Serial Display - Blue (COM-11442) SparkFun OpenSegment Serial Display - 20mm (Blue) (COM-11647) SparkFun OpenSegment Serial Display - 20mm (Green) (COM-11646) SparkFun OpenSegment Serial Display - 20mm (White) (COM-11648) SparkFun OpenSegment Serial Display - 20mm (Red) (COM-11644) SparkFun OpenSegment Serial Display - 20mm (Yellow) (COM-11645) SparkFun OpenSegment Shield (DEV-13190); PROD_ID: IC-09069
U3 = CH340E:CH340E: WCH.CN/CH340E See DataSheet： wch.cn
U4-U7 U9-U12 = SparkFun-IC-Logic:74*595: 8-Bit Shift Register (Serial to Parallel) Datasheet SparkFun Products SparkFun Shift Register Breakout - 74HC595 (BOB-10680); PROD_ID: IC-07875
U8 = ESP8266-12E_ESP-12E:ESP8266-12E/ESP-12E: ESP-12E WiFi Module; AVAILABILITY: Unavailable; DESCRIPTION: This WiFi module has a 32-bit MCU micro and clock speeds supporting 80 MHz or 160 MHz. Supports the RTOS and integrated Wi-Fi MAC/BB/RF/PA/LNA, and has an on-board antenna.; MF: AI-Thinker; MP: ESP8266-12E/ESP-12E; PACKAGE: None; PRICE: None